# EAGLE design revA (EAGLE 6.3)

## Sheet 1 of 5: MCU
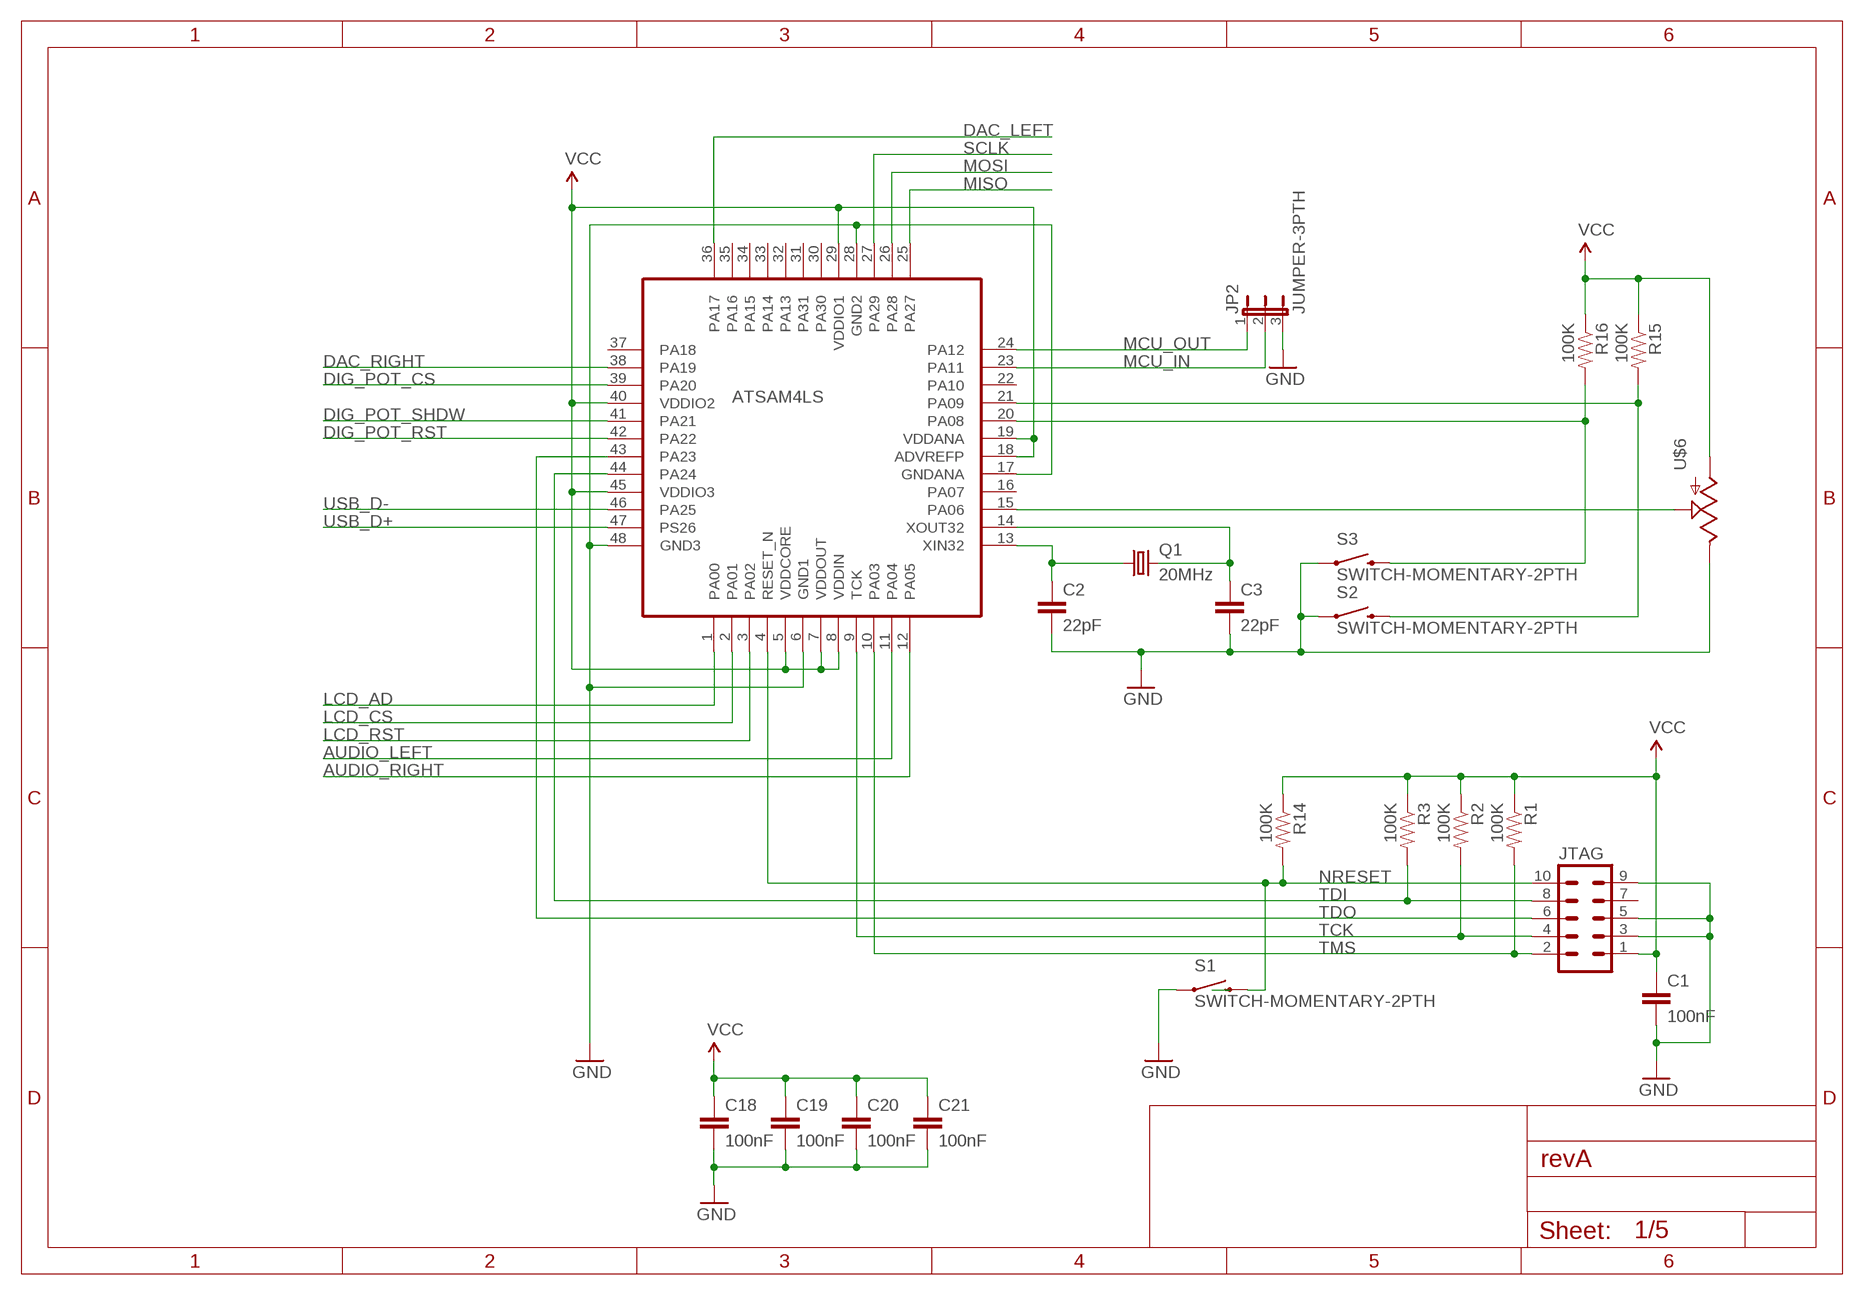
[diagram p0: schematic, sheet 1]

### Parts
ATSAM4LS  ATSAM4LSAA-AUR  [TQFP48]
C1  100nF  CAP0805  [0805]
C2  22pF  CAP0805  [0805]
C3  22pF  CAP0805  [0805]
C18  100nF  CAP0805  [0805]
C19  100nF  CAP0805  [0805]
C20  100nF  CAP0805  [0805]
C21  100nF  CAP0805  [0805]
JP2  JUMPER-3PTH  [1X03]
JTAG  MA05-2  [MA05-2]
Q1  20MHz  CRYSTALHC49UV  [HC49U-V]
R1  100K  RESISTOR1206  [1206]
R2  100K  RESISTOR1206  [1206]
R3  100K  RESISTOR1206  [1206]
R14  100K  RESISTOR1206  [1206]
R15  100K  RESISTOR1206  [1206]
R16  100K  RESISTOR1206  [1206]
S1  SWITCH-MOMENTARY-2PTH  [TACTILE-PTH]
S2  SWITCH-MOMENTARY-2PTH  [TACTILE-PTH]
S3  SWITCH-MOMENTARY-2PTH  [TACTILE-PTH]
U$6  POTTRIM  [TRIM_POT]

### Nets
AUDIO_LEFT: ATSAM4LS.11(PA04) ; also sheet 2
AUDIO_RIGHT: ATSAM4LS.12(PA05) ; also sheet 2
DAC_LEFT: ATSAM4LS.36(PA17) ; also sheet 3
DAC_RIGHT: ATSAM4LS.38(PA19) ; also sheet 3
DIG_POT_CS: ATSAM4LS.39(PA20) ; also sheet 2
DIG_POT_RST: ATSAM4LS.42(PA22) ; also sheet 2
DIG_POT_SHDW: ATSAM4LS.41(PA21) ; also sheet 2
GND: ATSAM4LS.6(GND1) ATSAM4LS.17(GNDANA) ATSAM4LS.28(GND2) ATSAM4LS.48(GND3) C1.2 C2.2 C3.2 C18.2 C19.2 C20.2 C21.2 JP2.3 JTAG.3 JTAG.5 JTAG.9 S1.1 S2.1 S3.1 U$6.2(E) ; also sheet 2,3,4,5
LCD_AD: ATSAM4LS.1(PA00) ; also sheet 5
LCD_CS: ATSAM4LS.2(PA01) ; also sheet 5
LCD_RST: ATSAM4LS.3(PA02) ; also sheet 5
MCU_IN: ATSAM4LS.23(PA11) JP2.2
MCU_OUT: ATSAM4LS.24(PA12) JP2.1
MISO: ATSAM4LS.25(PA27) ; also sheet 2
MOSI: ATSAM4LS.26(PA28) ; also sheet 2,5
N$1: ATSAM4LS.14(XOUT32) C3.1 Q1.2
N$2: ATSAM4LS.13(XIN32) C2.1 Q1.1
N$13: ATSAM4LS.15(PA06) U$6.1(S)
N$14: ATSAM4LS.21(PA09) R15.2 S2.3
N$20: ATSAM4LS.20(PA08) R16.2 S3.3
NRESET: ATSAM4LS.4(RESET_N) JTAG.10 R14.2 S1.3
SCLK: ATSAM4LS.27(PA29) ; also sheet 2,5
TCK: ATSAM4LS.9(TCK) JTAG.4 R2.2
TDI: ATSAM4LS.44(PA24) JTAG.8 R3.2
TDO: ATSAM4LS.43(PA23) JTAG.6
TMS: ATSAM4LS.10(PA03) JTAG.2 R1.2
USB_D+: ATSAM4LS.47(PS26) ; also sheet 4
USB_D-: ATSAM4LS.46(PA25) ; also sheet 4
VCC: ATSAM4LS.5(VDDCORE) ATSAM4LS.7(VDDOUT) ATSAM4LS.8(VDDIN) ATSAM4LS.18(ADVREFP) ATSAM4LS.19(VDDANA) ATSAM4LS.29(VDDIO1) ATSAM4LS.40(VDDIO2) ATSAM4LS.45(VDDIO3) C1.1 C18.1 C19.1 C20.1 C21.1 JTAG.1 R1.1 R2.1 R3.1 R14.1 R15.1 R16.1 U$6.3(A) ; also sheet 2,3,4,5
Unconnected: ATSAM4LS.16(PA07) ATSAM4LS.22(PA10) ATSAM4LS.30(PA30) ATSAM4LS.31(PA31) ATSAM4LS.32(PA13) ATSAM4LS.33(PA14) ATSAM4LS.34(PA15) ATSAM4LS.35(PA16) ATSAM4LS.37(PA18) JTAG.7

## Sheet 2 of 5: Analogue Input Stage
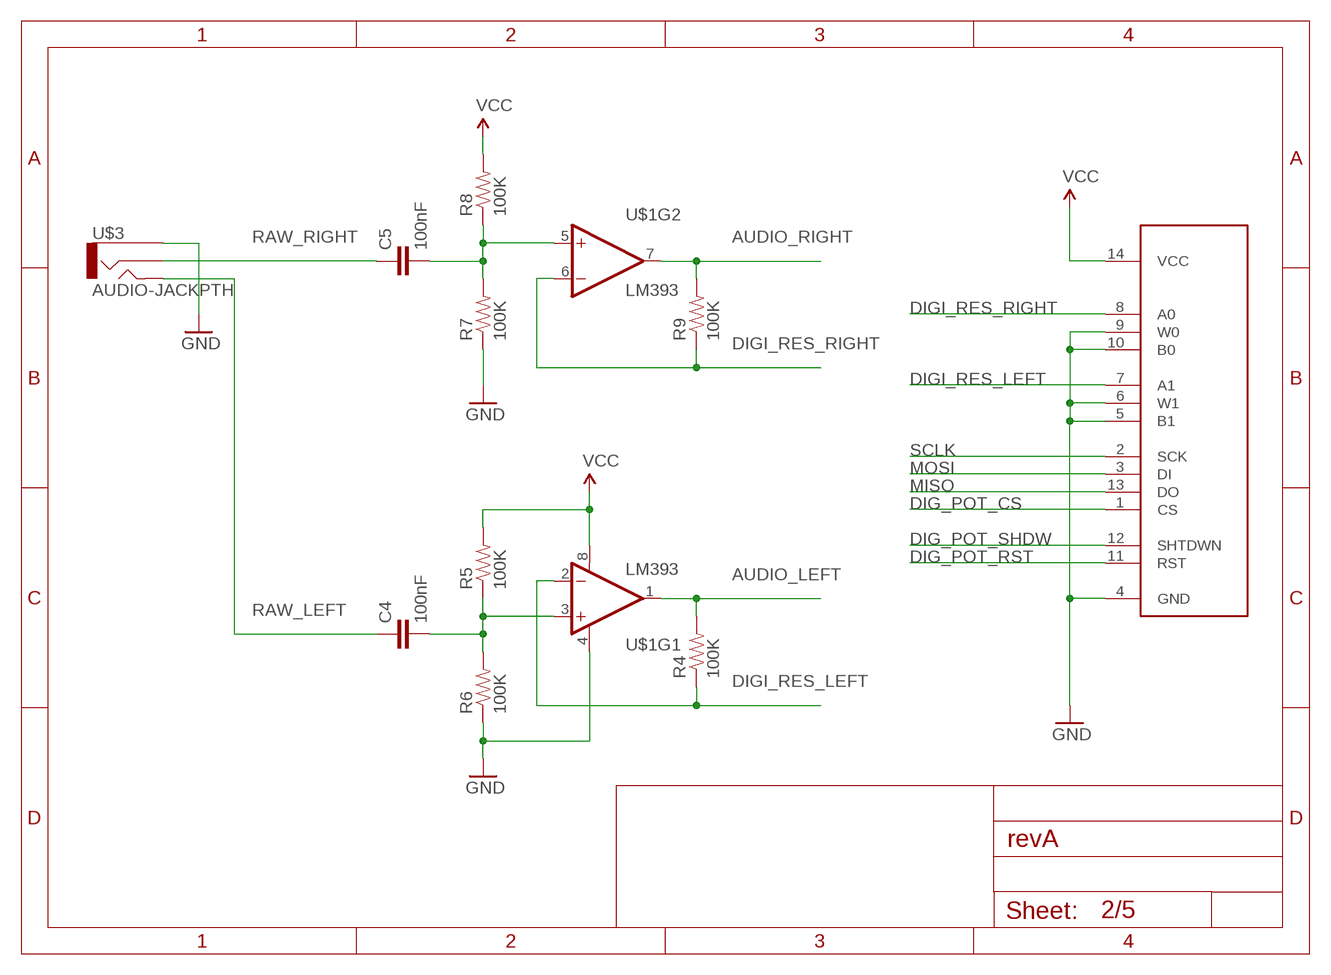
[diagram p1: schematic, sheet 2]

### Parts
C4  100nF  CAP0805  [0805]
C5  100nF  CAP0805  [0805]
R4  100K  RESISTOR1206  [1206]
R5  100K  RESISTOR1206  [1206]
R6  100K  RESISTOR1206  [1206]
R7  100K  RESISTOR1206  [1206]
R8  100K  RESISTOR1206  [1206]
R9  100K  RESISTOR1206  [1206]
U1  MCP42XXX  [SO014]
U$1  LM393  [SO08]
U$3  AUDIO-JACKPTH  [AUDIO-JACK]

### Nets
AUDIO_LEFT: R4.2 U$1.1(OUT) ; also sheet 1
AUDIO_RIGHT: R9.2 U$1.7(OUT) ; also sheet 1
DIG_POT_CS: U1.1(CS) ; also sheet 1
DIG_POT_RST: U1.11(RST) ; also sheet 1
DIG_POT_SHDW: U1.12(SHTDWN) ; also sheet 1
DIGI_RES_LEFT: R4.1 U1.7(A1) U$1.2(-IN)
DIGI_RES_RIGHT: R9.1 U1.8(A0) U$1.6(-IN)
GND: R6.1 R7.1 U1.4(GND) U1.5(B1) U1.6(W1) U1.9(W0) U1.10(B0) U$1.4(V-) U$3.1 ; also sheet 1,3,4,5
MISO: U1.13(DO) ; also sheet 1
MOSI: U1.3(DI) ; also sheet 1,5
N$5: C5.2 R7.2 R8.1 U$1.5(+IN)
N$6: C4.2 R5.1 R6.2 U$1.3(+IN)
RAW_LEFT: C4.1 U$3.5
RAW_RIGHT: C5.1 U$3.2
SCLK: U1.2(SCK) ; also sheet 1,5
VCC: R5.2 R8.2 U1.14(VCC) U$1.8(V+) ; also sheet 1,3,4,5

## Sheet 3 of 5: Analogue Output Stage
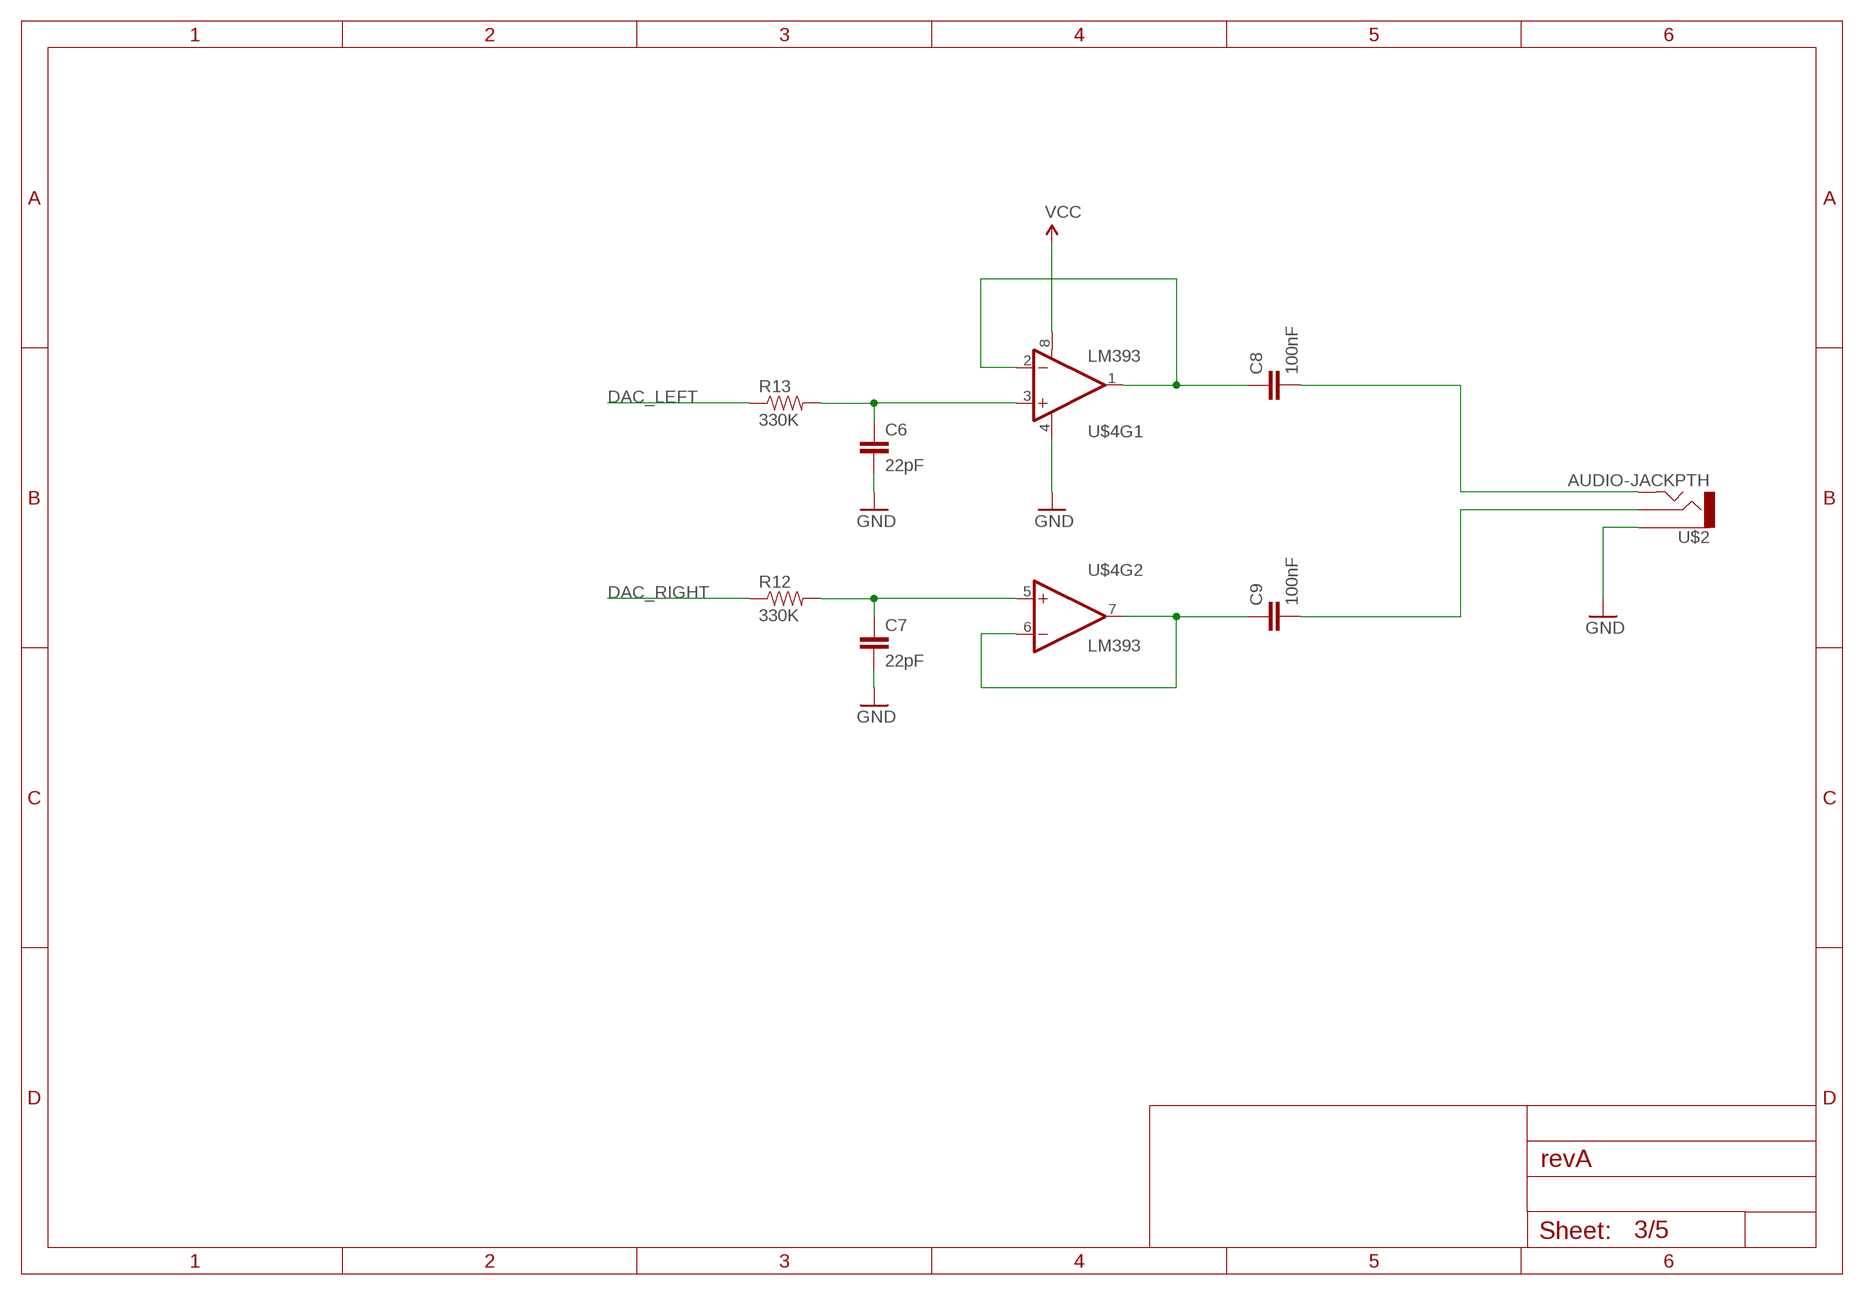
[diagram p2: schematic, sheet 3]

### Parts
C6  22pF  CAP0805  [0805]
C7  22pF  CAP0805  [0805]
C8  100nF  CAP0805  [0805]
C9  100nF  CAP0805  [0805]
R12  330K  RESISTOR1206  [1206]
R13  330K  RESISTOR1206  [1206]
U$2  AUDIO-JACKPTH  [AUDIO-JACK]
U$4  LM393  [SO08]

### Nets
DAC_LEFT: R13.1 ; also sheet 1
DAC_RIGHT: R12.1 ; also sheet 1
GND: C6.2 C7.2 U$2.1 U$4.4(V-) ; also sheet 1,2,4,5
N$7: C9.1 U$4.6(-IN) U$4.7(OUT)
N$8: C9.2 U$2.2
N$9: C8.1 U$4.1(OUT) U$4.2(-IN)
N$10: C6.1 R13.2 U$4.3(+IN)
N$11: C7.1 R12.2 U$4.5(+IN)
N$12: C8.2 U$2.5
VCC: U$4.8(V+) ; also sheet 1,2,4,5

## Sheet 4 of 5: MISC
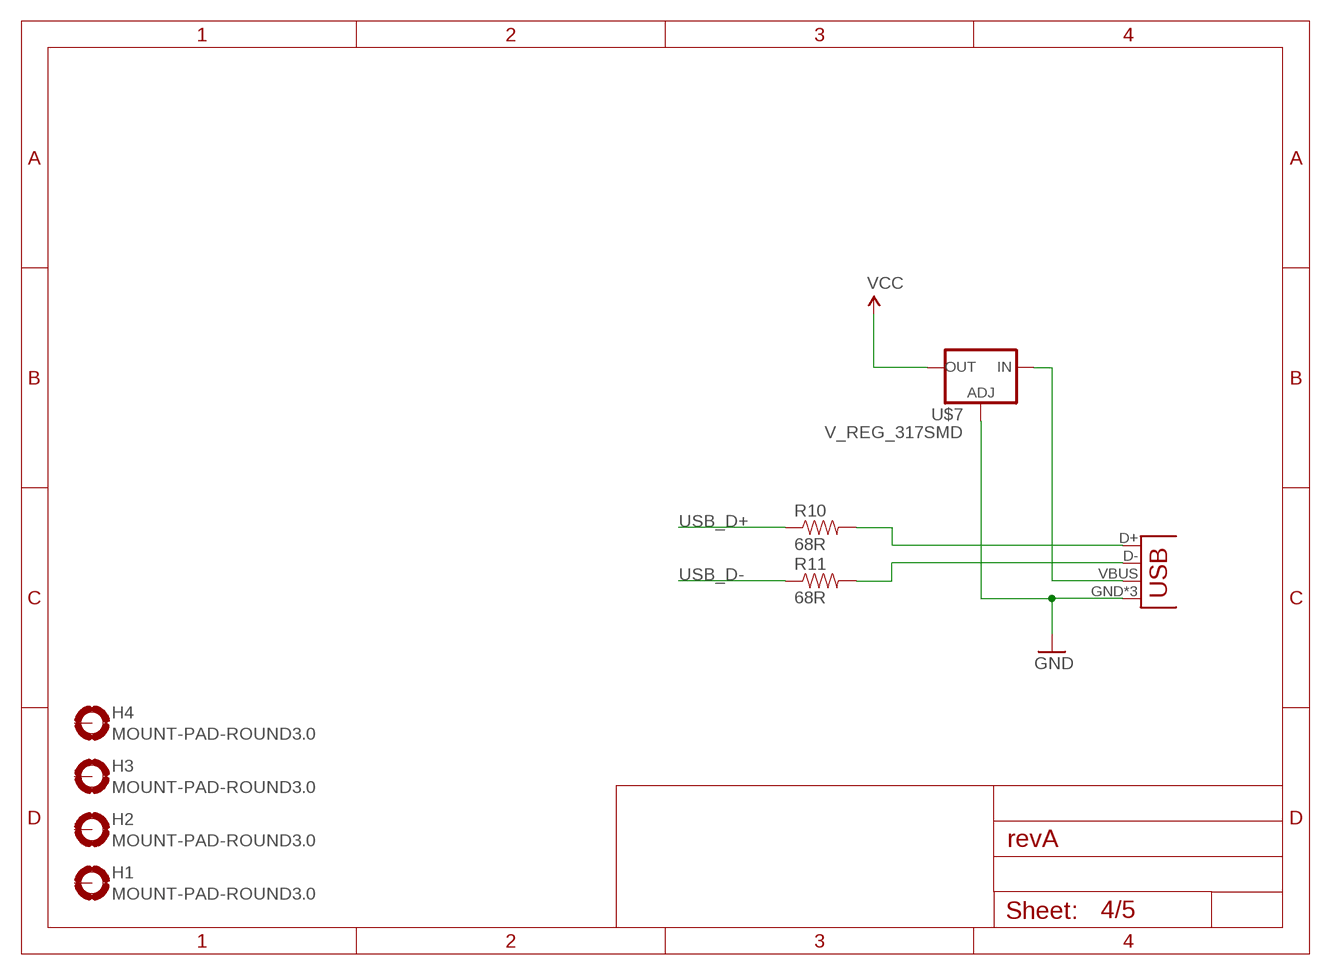
[diagram p3: schematic, sheet 4]

### Parts
H1  MOUNT-PAD-ROUND3.0  [3,0-PAD]
H2  MOUNT-PAD-ROUND3.0  [3,0-PAD]
H3  MOUNT-PAD-ROUND3.0  [3,0-PAD]
H4  MOUNT-PAD-ROUND3.0  [3,0-PAD]
JP1  USB-MICROB  [USB-MICROB]
R10  68R  RESISTOR1206  [1206]
R11  68R  RESISTOR1206  [1206]
U$7  V_REG_317SMD  [SOT223]

### Nets
GND: JP1.GND JP1.MT1(GND) JP1.MT2(GND) U$7.1(ADJ) ; also sheet 1,2,3,5
N$3: JP1.D- R11.2
N$4: JP1.D+ R10.2
N$33: JP1.VBUS U$7.3(IN)
USB_D+: R10.1 ; also sheet 1
USB_D-: R11.1 ; also sheet 1
VCC: U$7.2(OUT) ; also sheet 1,2,3,5
Unconnected: H1.B3,0(MOUNT) H2.B3,0(MOUNT) H3.B3,0(MOUNT) H4.B3,0(MOUNT)

## Sheet 5 of 5: Screen
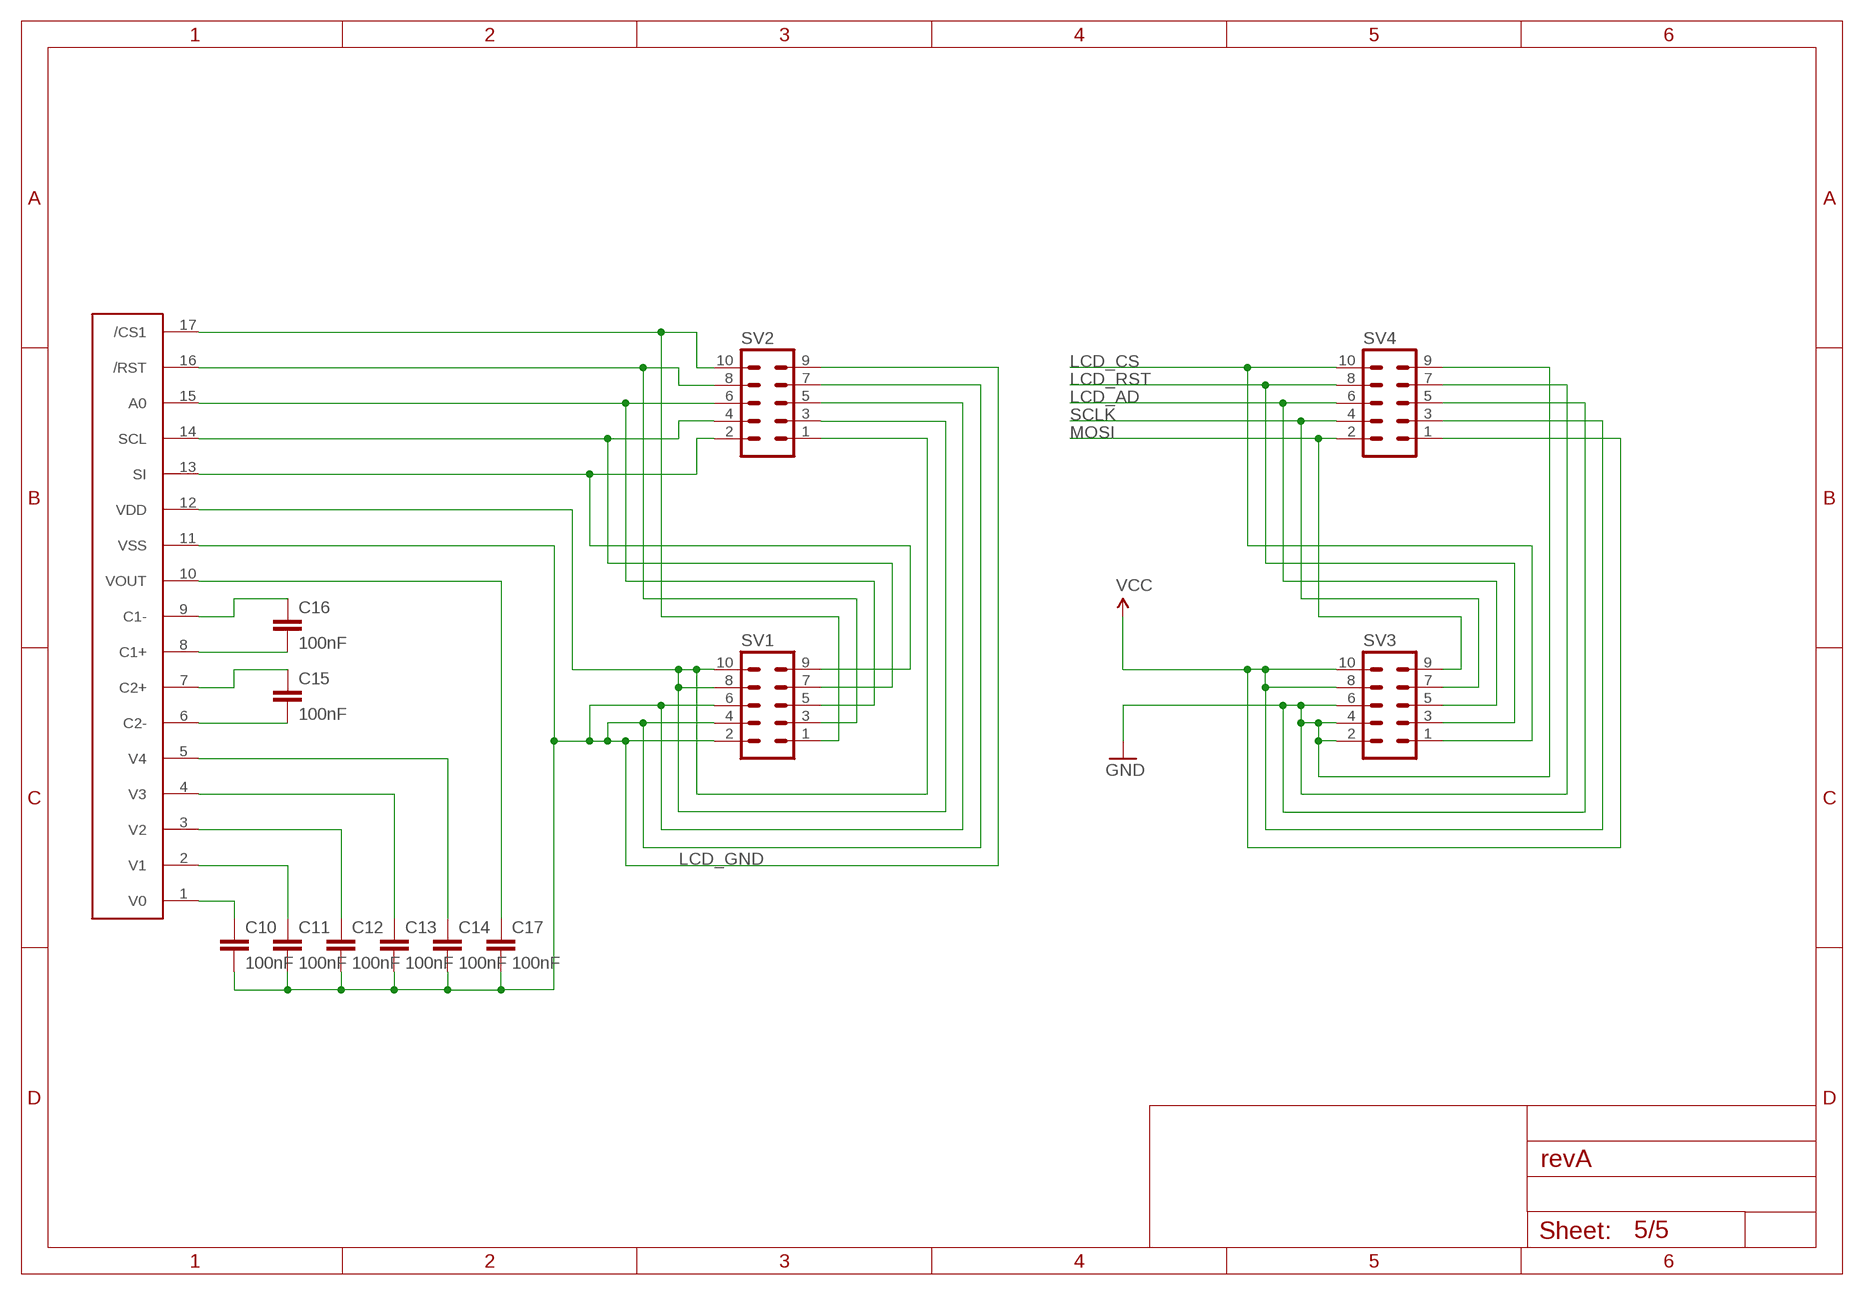
[diagram p4: schematic, sheet 5]

### Parts
C10  100nF  CAP0805  [0805]
C11  100nF  CAP0805  [0805]
C12  100nF  CAP0805  [0805]
C13  100nF  CAP0805  [0805]
C14  100nF  CAP0805  [0805]
C15  100nF  CAP0805  [0805]
C16  100nF  CAP0805  [0805]
C17  100nF  CAP0805  [0805]
SV1  MA05-2  [MA05-2]
SV2  MA05-2  [MA05-2]
SV3  MA05-2  [MA05-2]
SV4  MA05-2  [MA05-2]
U$5  NHD_128X32  [NHD_128X32]

### Nets
GND: SV3.2 SV3.4 SV3.6 SV4.5 SV4.7 SV4.9 ; also sheet 1,2,3,4
LCD_AD: SV3.5 SV4.6 ; also sheet 1
LCD_CS: SV3.1 SV4.10 ; also sheet 1
LCD_GND: C10.2 C11.2 C12.2 C13.2 C14.2 C17.2 SV1.2 SV1.4 SV1.6 SV2.5 SV2.7 SV2.9 U$5.11(VSS)
LCD_RST: SV3.3 SV4.8 ; also sheet 1
MOSI: SV3.9 SV4.2 ; also sheet 1,2
N$15: C10.1 U$5.1(V0)
N$16: C11.1 U$5.2(V1)
N$17: C12.1 U$5.3(V2)
N$18: C13.1 U$5.4(V3)
N$19: C14.1 U$5.5(V4)
N$21: SV1.8 SV1.10 SV2.1 SV2.3 U$5.12(VDD)
N$23: C15.2 U$5.6(C2-)
N$24: C15.1 U$5.7(C2+)
N$25: C16.2 U$5.8(C1+)
N$26: C16.1 U$5.9(C1-)
N$27: C17.1 U$5.10(VOUT)
N$28: SV1.1 SV2.10 U$5.17(/CS1)
N$29: SV1.3 SV2.8 U$5.16(/RST)
N$30: SV1.5 SV2.6 U$5.15(A0)
N$31: SV1.7 SV2.4 U$5.14(SCL)
N$32: SV1.9 SV2.2 U$5.13(SI)
SCLK: SV3.7 SV4.4 ; also sheet 1,2
VCC: SV3.8 SV3.10 SV4.1 SV4.3 ; also sheet 1,2,3,4

## Library data of the parts
ATSAM4LS = atmel:ATSAM4LSAA-AUR
C1-C21 = SparkFun:CAP: Capacitor Standard 0603 ceramic capacitor, and 0.1" leaded capacitor.
H1-H4 = holes:MOUNT-PAD-ROUND: MOUNTING PAD, round
JP1 = SparkFun-Connectors:USB: USB Connectors USB-B-PTH is fully proven SKU : PRT-00139/CONN-08278 USB-miniB is fully proven SKU : PRT-00587 USB-A-PCB is untested. USB-A-H is throughly reviewed, but untested. Spark Fun Electronics SKU : PRT-00437 USB-B-SMT is throughly reviewed, but untested. Needs silkscreen touching up. USB-A-S has not been used/tested USB-MB-H has not been used/tested USB-MICROB has been used. CONN-09505; PROD_ID: CONN-09505
JP2 = SparkFun:JUMPER-3
JTAG SV1-SV4 = con-lstb:MA05-2: PIN HEADER; OC_FARNELL: unknown; OC_NEWARK: unknown
Q1 = SparkFun:CRYSTAL: Crystals Various standard crystals. Proven footprints. Spark Fun Electronics SKU : COM-00534
R1-R16 = SparkFun:RESISTOR: Resistor Basic schematic elements and footprints for 0603, 1206, and PTH 1/10th watt (small) resistors.
S1-S3 = SparkFun:SWITCH-MOMENTARY-2
U1 = SparkFun:MCP42XXX
U$1 U$4 = SparkFun:LM393
U$2 U$3 = SparkFun:AUDIO-JACK: 3.5mm Audio Jack Simple 3.5mm common PCB mount audio jack. SKU: PRT-08032
U$5 = newhaven:NHD_128X32
U$6 = SparkFun:POT
U$7 = SparkFun:V_REG_317: Voltage Regulator Standard LM317 adjustable voltage regulator. AOI (Adjust Output Input). Google 'LM317 Calculator' for easy to use app to get the two resistor values needed. 240/720 for 5V output. 240/390 for 3.3V output. Spark Fun Electronics SKU : COM-00527

## Board
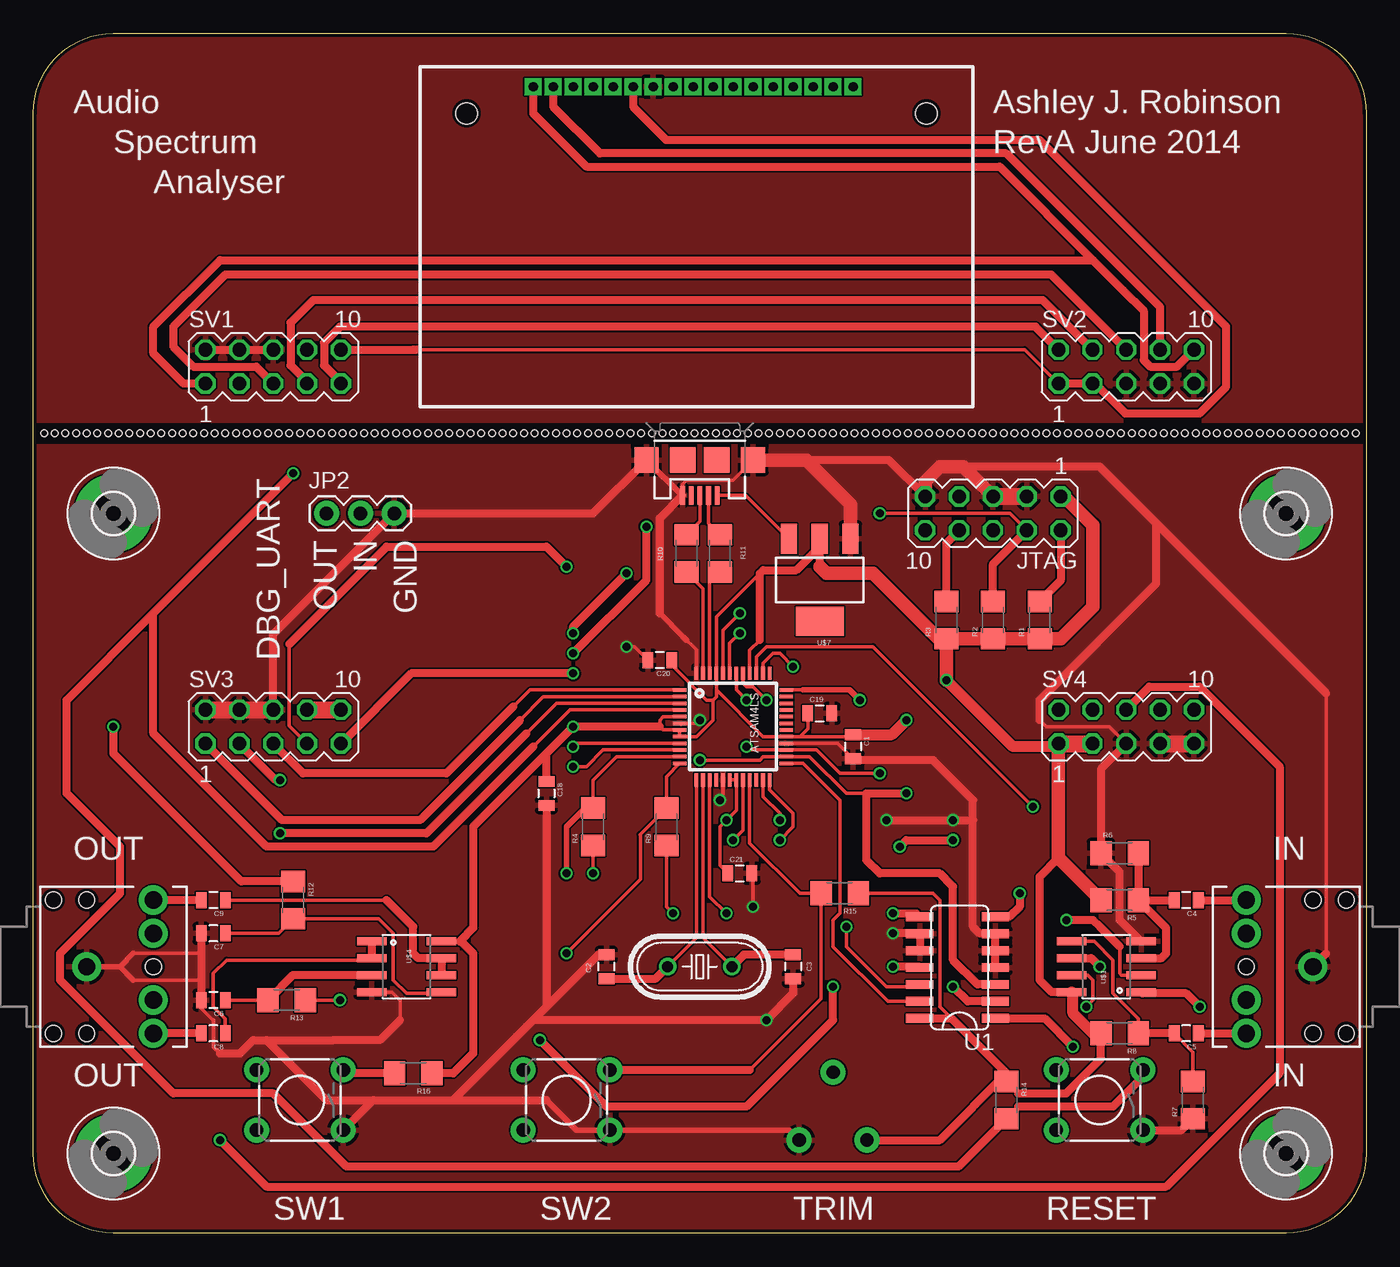
[diagram p5: board, top side]
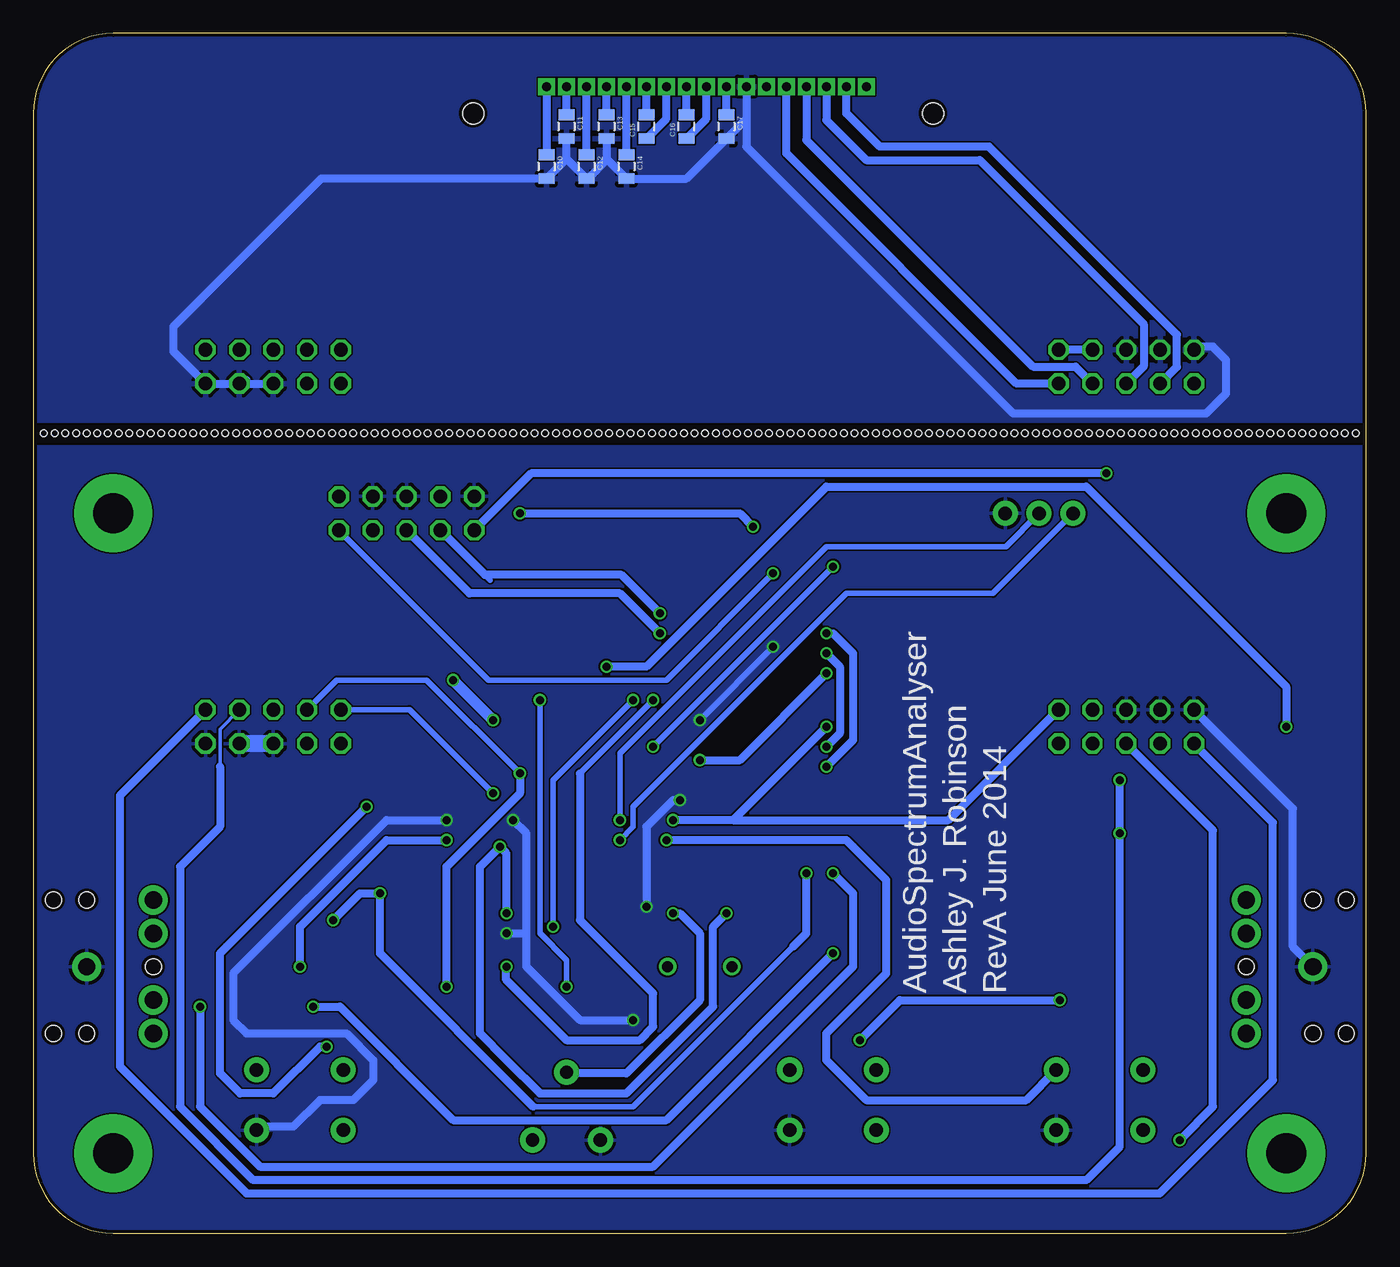
[diagram p6: board, bottom side, seen from below]

Size 100 x 90 mm. Coordinates in mm from the lower left corner, seen from the top.
Outline: 0,6 0,84 arc-90 6,90 94,90 arc-90 100,84 100,6 arc-90 94,0 6,0 arc-90 0,6
Copper layers (1*16): Top 0.035mm / dielectric 1.5mm / Bottom 0.035mm
Design rules "dirt_cheap_dirty_boards.v1": minimum track width 5mil, minimum drill 12mil, track to track 5mil, track to pad 5mil, pad to pad 5mil, via to via 5mil, smd to smd 0mil, copper to edge 10mil, drill to drill 10mil, minimum pad ring 10mil, minimum via ring 6mil, stop-mask expansion 2mil, vias tented up to drill 25mil, thermal gap 10mil
Holes 0.5 mm at 15.2,60 16.8,60 17.6,60 16,60 19.2,60 20,60 18.4,60 21.6,60 22.4,60 20.8,60 24,60 24.8,60 23.2,60 26.4,60 27.2,60 25.6,60 28.8,60 29.6,60 28,60 31.2,60 32,60 30.4,60 33.6,60 34.4,60 32.8,60 36,60 36.8,60 35.2,60 38.4,60 39.2,60 37.6,60 40.8,60 41.6,60 40,60 43.2,60 44,60 42.4,60 44.8,60 45.6,60 47.2,60 48,60 46.4,60 49.6,60 50.4,60 48.8,60 52,60 52.8,60 51.2,60 54.4,60 55.2,60 53.6,60 56.8,60 57.6,60 56,60 59.2,60 60,60 58.4,60 61.6,60 62.4,60 60.8,60 64,60 64.8,60 63.2,60 66.4,60 67.2,60 65.6,60 68.8,60 69.6,60 68,60 71.2,60 72,60 70.4,60 73.6,60 74.4,60 72.8,60 76,60 76.8,60 75.2,60 78.4,60 79.2,60 77.6,60 80.8,60 81.6,60 80,60 83.2,60 84,60 82.4,60 84.8,60 12,60 13.6,60 14.4,60 12.8,60 4.8,60 6.4,60 7.2,60 5.6,60 8.8,60 9.6,60 8,60 11.2,60 10.4,60 1.6,60 3.2,60 4,60 2.4,60 0.8,60 85.6,60 86.4,60 88,60 88.8,60 87.2,60 90.4,60 91.2,60 89.6,60 92.8,60 93.6,60 92,60 95.2,60 96,60 94.4,60 97.6,60 98.4,60 96.8,60 99.2,60

### Footprints (pad centres in the part's own frame; a part is rotated, then mirrored left to right if it is on the bottom)
TQFP48 = smd 0.27 x 1: 1 -2.751,-4.003; 2 -2.251,-4.003; 3 -1.751,-4.003; 4 -1.251,-4.003; 5 -0.751,-4.003; 6 -0.251,-4.003; 7 0.249,-4.003; 8 0.749,-4.003; 9 1.249,-4.003; 10 1.749,-4.003; 11 2.249,-4.003; 12 2.749,-4.003; 25 2.749,3.997; 26 2.249,3.997; 27 1.749,3.997; 28 1.249,3.997; 29 0.749,3.997; 30 0.249,3.997; 31 -0.251,3.997; 32 -0.751,3.997; 33 -1.251,3.997; 34 -1.751,3.997; 35 -2.251,3.997; 36 -2.751,3.997 | smd 1 x 0.27: 13 3.999,-2.753; 14 3.999,-2.253; 15 3.999,-1.753; 16 3.999,-1.253; 17 3.999,-0.753; 18 3.999,-0.253; 19 3.999,0.247; 20 3.999,0.747; 21 3.999,1.247; 22 3.999,1.747; 23 3.999,2.247; 24 3.999,2.747; 37 -4.001,2.747; 38 -4.001,2.247; 39 -4.001,1.747; 40 -4.001,1.247; 41 -4.001,0.747; 42 -4.001,0.247; 43 -4.001,-0.253; 44 -4.001,-0.753; 45 -4.001,-1.253; 46 -4.001,-1.753; 47 -4.001,-2.253; 48 -4.001,-2.753
0805 = smd 0.8 x 1.2: 1 -0.9,0; 2 0.9,0
3,0-PAD = drill 3 pad 5.842: B3,0 0,0
USB-MICROB = smd 0.35 x 1.4: D+ 0,2.65; D- -0.65,2.65; GND 1.3,2.65; ID 0.65,2.65; VBUS -1.3,2.65 | smd 1.8 x 1.9: MT1 -4,0; MT2 4,0 | smd 1.9 x 1.9: P$1 -1.27,0; P$2 1.27,0
1X03 = drill 1.016 pad 1.88: 1 0,0; 2 2.54,0; 3 5.08,0
MA05-2 = drill 1.016 octagon: 1 -5.08,-1.27; 2 -5.08,1.27; 3 -2.54,-1.27; 4 -2.54,1.27; 5 0,-1.27; 6 0,1.27; 7 2.54,-1.27; 8 2.54,1.27; 9 5.08,-1.27; 10 5.08,1.27
HC49U-V = drill 0.813: 1 -2.413,0; 2 2.413,0
1206 = smd 1.6 x 1.8: 1 -1.4,0; 2 1.4,0
TACTILE-PTH = drill 1.016 pad 1.88: 1 -3.251,2.261; 2 3.251,2.261; 3 -3.251,-2.261; 4 3.251,-2.261
SO014 = smd 0.66 x 2.032: 1 -3.175,-2.68; 2 -1.905,-2.68; 3 -0.635,-2.68; 4 0.635,-2.68; 5 1.905,-2.68; 6 3.175,-2.68; 7 4.445,-2.68; 8 4.445,2.997; 9 3.175,2.997; 10 1.905,2.997; 11 0.635,2.997; 12 -0.635,2.997; 13 -1.905,2.997; 14 -3.175,2.997
SO08 = smd 0.61 x 2.21: 1 -1.905,-2.616; 2 -0.635,-2.616; 3 0.635,-2.616; 4 1.905,-2.616; 5 1.905,2.616; 6 0.635,2.616; 7 -0.635,2.616; 8 -1.905,2.616
AUDIO-JACK = drill 1.3 pad 2.184: 1 0,0; 2 5,5; 3 5,2.5; 4 5,-2.5; 5 5,-5 | hole 1.2: 0,5; -2.5,5; -2.5,-5; 0,-5; 5,0
NHD_128X32 = drill 0.7 pad 1.27 square: 1 32.5,24; 2 31,24; 3 29.5,24; 4 28,24; 5 26.5,24; 6 25,24; 7 23.5,24; 8 22,24; 9 20.5,24; 10 19,24; 11 17.5,24; 12 16,24; 13 14.5,24; 14 13,24; 15 11.5,24; 16 10,24; 17 8.5,24 | hole 1.6: 3.5,22; 38,22
TRIM_POT = drill 1 pad 1.88: 1 5.08,0; 2 0,2.54; 3 0,-2.54
SOT223 = smd 1.219 x 2.235: 1 -2.311,-3.099; 2 0,-3.099; 3 2.311,-3.099 | smd 3.6 x 2.2: 4 0,3.099

### Placement (x,y rotation side)
ATSAM4LS  52.5,38 270 top
C1  61.5,36.5 270 top
C2  43,20 90 top
C3  57,20 270 top
C4  86.5,25 180 top
C5  86.5,15 180 top
C6  13.5,17.5 180 top
C7  13.5,22.5 180 top
C8  13.5,15 180 top
C9  13.5,25 180 top
C10  61.5,80 270 bottom
C11  60,83 270 bottom
C12  58.5,80 270 bottom
C13  57,83 270 bottom
C14  55.5,80 270 bottom
C15  54,83 90 bottom
C16  51,83 90 bottom
C17  48,83 270 bottom
C18  38.5,33 270 top
C19  59,39 0 top
C20  47,43 180 top
C21  53,27 0 top
H1  6,6 0 top
H2  94,6 0 top
H3  6,54 0 top
H4  94,54 0 top
JP1  50,58 180 top
JP2  22,54 0 top
JTAG  72,54 180 top
Q1  50,20 0 top
R1  75.5,46 90 top
R2  72,46 90 top
R3  68.5,46 90 top
R4  42,30.5 90 top
R5  81.5,25 180 top
R6  81.5,28.5 0 top
R7  87,10 90 top
R8  81.5,15 180 top
R9  47.5,30.5 90 top
R10  49,51 90 top
R11  51.5,51 90 top
R12  19.5,25 270 top
R13  19,17.5 180 top
R14  73,10 270 top
R15  60.5,25.5 180 top
R16  28.5,12 180 top
S1  80,10 180 top
S2  40,10 180 top
S3  20,10 180 top
SV1  18,65 0 top
SV2  82,65 0 top
SV3  18,38 0 top
SV4  82,38 0 top
U1  69.5,19.3 90 top
U$1  80.5,20 90 top
U$2  4,20 0 top
U$3  96,20 180 top
U$4  28,20 270 top
U$5  29,62 0 top
U$6  60,7 90 top
U$7  59,49 180 top

### Tracks (layer width: path | path; a pad name or v marks a point on that pad's centre or on a via)
AUDIO_LEFT  (via drill 0.6)
  Top 0.254: ATSAM4LS.11 43.75,35.75 42,34 42,32.5 R4.2 | U$1.1 83.21,18
  Top 0.406: v40,27 40,30.5 42,32.5
  Top 0.61: v87.5,17 86.5,18 83.21,18
  Bottom 0.61: v40,27 38.5,25.5 38.5,20 53.5,5 83,5 87.5,9.5 v87.5,17
AUDIO_RIGHT  (via drill 0.6)
  Top 0.254: ATSAM4LS.12 47.5,34.25 R9.2 45.55,29.95 | 45.55,29.95 45.5,29.9 | v79,17 79.5,17.5 79.5,19 79.14,19.36 U$1.7 | v40,21 45.55,26.55 45.55,29.95
  Bottom 0.61: v79,17 77,17 68.5,8.5 52.5,8.5 v40,21
DAC_LEFT  (via drill 0.6)
  Top 0.254: R13.1 v23,17.5 | ATSAM4LS.36 57.75,40.75
  Top 0.406: 57.75,40.75 61.25,40.75 v62,40
  Top 0.61: v60,18.5 60,16 53.5,9.5 43,9.5 v38,14.5
  Bottom 0.406: v60,18.5 60,20.5 62,22.5 v62,40
  Bottom 0.61: v38,14.5 35,17.5 v23,17.5
DAC_RIGHT  (via drill 0.6)
  Top 0.254: ATSAM4LS.38 54.75,42.75 55.5,43.5 56,43.5 v57,42.5
  Top 0.61: v6,38 6,36 15.6,26.4 R12.1
  Bottom 0.61: v6,38 6,41 21,56 40.5,56 54,42.5 v57,42.5
DIG_POT_CS  (via drill 0.6)
  Top 0.254: ATSAM4LS.39 54.25,43.25 55,44 63,44 v75,32
  Top 0.61: U1.1 75.88,16.12 v78,14
  Bottom 0.61: v75,32 85.5,21.5 86,21 86,12 84.5,10.5 82,10.5 78.5,14 v78,14
DIG_POT_RST  (via drill 0.6)
  Top 0.254: ATSAM4LS.42 52.75,40.75 v53.5,40 | U1.11 66.44,20
  Top 0.61: 66.44,20 v64.5,20
  Bottom 0.254: v64.5,20 64.56,19.93
  Bottom 0.406: v53.5,40 59,34.5
  Bottom 0.61: 59,34.5 59,23.5 53.5,18 53.5,15.5 54.5,14.5 60,14.5 64.56,19.07 64.56,19.93
DIG_POT_SHDW  (via drill 0.6)
  Top 0.254: ATSAM4LS.41 53.25,41.25 53.5,41 54,41 v55,40 | v61,23 61,21.5 64,18.5 66.34,18.5 U1.12
  Bottom 0.406: v55,40 61,34 v61,23
DIGI_RES_LEFT  (via drill 0.6)
  Top 0.254: U$1.2 81.64,19.36 81.5,19.5 81.5,21.5 | R4.1 v42,27
  Top 0.406: U1.7 73.25,23.75
  Top 0.61: 81.5,21.5 80,23 79.5,23.5 v77.5,23.5 | v74,25.5 74,24.5 73.25,23.75
  Bottom 0.406: 62.5,9.5 55,9.5 43,21.5
  Bottom 0.61: 43,21.5 42,22.5 v42,27 | 62.5,9.5 74,21 v74,25.5 75.5,25.5 v77.5,23.5
DIGI_RES_RIGHT  (via drill 0.6)
  Top 0.254: R9.1 47.5,24.5 v48,24 | 66.25,24 U1.8
  Top 0.61: v64.5,24 66.25,24 | U$1.6 79.36,20.64 v80,20 | v65,29 65.5,29.5 v69,29.5
  Bottom 0.61: v48,24 49,23 49,17 55.5,10.5 62,10.5 64.5,13 66.5,15 66.5,27.5 v65,29 64.5,28.5 v64.5,24 | v80,20 80,23 73.5,29.5 v69,29.5
GND  (via drill 0.6)
  Top 0.254: 48.65,55.35 JP1.GND 48.7,56.2 49,56.5 52.5,56.5 JP1.MT1 | ATSAM4LS.28 60.35,36.75 C1.2 | 66.48,22.5 U1.9 | U$1.4 83.09,21.91 | 79.5,29 79.6,29 R6.1 | SV4.9 87.73,36.73 | 97,21 97,40.5 | SV4.5 80.73,38 76,38 75.5,38.5 | C6.2 12.6,16.9 13.5,16 | 7.5,19 12.6,19 | U$4.4 26.91,18.09 27.5,17.5 27.5,16 | C2.2 42.4,20.9 | 37.5,16 37,15.5 | ATSAM4LS.48 49.75,43.75 48.75,44.75 | 7.5,21 12.6,21 | ATSAM4LS.17 51.75,32.75 v51.5,32.5 | v54,24.5 54,26.9 C21.2 | 38.5,17 36.25,14.75 | ATSAM4LS.6 49.75,38.25 v50,38.5 | v44.5,44 45.1,44 C20.2
  Top 0.305: 13.5,16 13.5,14 14,13.5 | S3.1 23.25,8.25
  Top 0.406: 48.65,55.35 JP1.MT2 | 61.6,35.5 C1.2 | 38.5,10 40.76,7.74 S2.1 56.72,7.74 U$6.2 | 47,46.5 48.75,44.75 49,44.5 | 6.5,20 7.5,21 | 6.5,20 7.5,19 | U$2.1 6.5,20
  Top 0.61: JP1.MT2 42,54 JP2.3 18,44.92 SV3.6 | C7.2 12.6,21 12.6,19 C6.2 | U1.9 U1.10 | U1.4 U1.5 U1.6 71.03,22.48 70.5,23 70.5,31 | 83.09,21.91 81.5,23.5 81.5,27.1 R6.1 80.1,34.83 SV4.5 | 97,40.5 84.25,53.25 | 84.25,53.25 80,57.5 68,57.5 | S1.1 86.14,7.74 R7.1 | U$3.1 97,21 | 75.5,38.5 75.5,40 84.25,48.75 84.25,53.25 | 25.51,10 31.5,10 | 31.5,10 38.5,10 | 70.5,31 70.5,32.5 67.5,35.5 61.6,35.5 | 42.4,20.9 37,15.5 36.25,14.75 31.5,10 | 27.5,16 26,14.5 22.5,14.5 17.5,14.5 | 37.5,16 v55,16 57,18 C3.2 | JTAG.9 64.19,58 57.5,58 | 47,46.5 47,53.65 JP1.GND | v64,31 v69,31 70.5,31 | 66.48,22.5 v64.5,22.5 | C18.2 38.5,17 | 14,13.5 15.5,13.5 16.5,14.5 17.5,14.5 | 25.51,10 S3.1 | 17.5,14.5 22,10 25.51,10
  Top 1.016: JP1.MT1 57.5,58 58,58 61.31,54.69 U$7.1 | JTAG.9 66.92,56.42 68,57.5 69.77,57.5 JTAG.5
  Top 1.27: JTAG.5 JTAG.3 | SV3.2 SV3.4 SV3.6 | SV4.7 SV4.9
  Bottom 0.254: S1.1
  Bottom 0.406: v50,38.5 v44.5,44
  Bottom 0.61: v55,16 59,16 63,20 63,22.5 | v69,31 73.5,31 85,19.5 85,16 84,15 76.5,15 74.5,13 74.5,11.5 76,10 78.5,10 80.5,8 82.99,8 S1.1 | 63,22.5 63,30 v64,31 | v64.5,22.5 63,22.5 | v51.5,32.5 52,32.5 54,30.5 v54,24.5 | U$2.1 5.5,21.5 5.5,31.85 SV3.2
  Bottom 1.27: SV4.5 SV4.7
  pour Bottom: -1,-1 -1,59 101,59 101,-1
  pour Top: -1,-1 -1,59 101,59 101,-1
LCD_AD  (via drill 0.6)
  Top 0.254: ATSAM4LS.1 37.25,40.75 36,39.5
  Top 0.61: SV4.6 83.73,41 87.5,41 93.5,35 93.5,12 85.75,4.25 85.5,4 85,3.5 17.5,3.5 v14,7 | 36,39.5 31,34.5 20.23,34.5 SV3.5
  Bottom 0.61: SV3.5 11.5,30.23 11.5,9.5 v14,7
LCD_CS
  Top 0.254: ATSAM4LS.2 38.25,40.25 36.5,38.5
  Top 0.61: 36.5,38.5 29,31 18.65,31 SV3.1
  Bottom 0.61: SV4.10 93.5,32.85 93.5,12.5 84,3 15.5,3 7,11.5 7,30.81 SV3.1
LCD_GND
  Top 0.61: SV1.2 SV1.4 SV1.6
  Bottom 0.61: C13.2 57,80.6 56.95,80.55 | 56.95,80.55 C14.2 51,79.1 C17.2 46.5,83.6 | 56.95,80.55 58.4,79.1 C12.2 59.95,80.55 | 59.95,80.55 60,80.6 C11.2 | 59.95,80.55 60.05,80.55 C10.2 78.4,79.1 89.5,68 89.5,66.15 SV2.9 SV2.7 | U$5.11 46.5,83.6 | SV2.7 84.27,63.73 84,64 84.27,64 SV2.7 | SV2.7 SV2.5 | 46.5,83.6 46.5,81.5 26.5,61.5 12,61.5 10.5,63 10.5,65.5 11.5,66.5 12.69,66.5 SV1.2
  pour Bottom: -1,61 -1,91 101,91 101,61
  pour Top: -1,61 -1,91 101,91 101,61
LCD_RST  (via drill 0.6)
  Top 0.254: ATSAM4LS.3 39.25,39.75 37,37.5
  Top 0.61: v18.5,34 18.19,34 SV3.3 | 37,37.5 29.5,30 v18.5,30
  Bottom 0.254: 15.23,36.73 SV3.3 | 86,35 86,37.81 SV4.8
  Bottom 0.61: 86,35 86,30.5 89,27.5 89,9.5 83.5,4 21,4 18.5,6.5 v18.5,30 v18.5,34
MCU_IN  (via drill 0.6)
  Top 0.254: ATSAM4LS.23 54.75,32.75 56,31.5 v56,31
  Bottom 0.406: v56,31 56,36 40.5,51.5 27.04,51.5 JP2.2
MCU_OUT  (via drill 0.6)
  Top 0.254: ATSAM4LS.24 55.25,33.25 57,31.5 57,30.5 v56,29.5
  Bottom 0.406: JP2.1 28,48 39,48 55,32 55,30.5 v56,29.5
MISO
  Top 0.254: ATSAM4LS.25 57.75,35.25 60.5,32.5 60.5,24 60,23.5 60,21.5 64.11,17.39 U1.13
MOSI  (via drill 0.6)
  Top 0.254: v50,35.5 54.5,35.5 54.75,35.75 ATSAM4LS.26 58.25,35.75 61,33 62.5,33
  Top 0.61: U1.3 70.83,18.66 69,20.5 69,26 68,27 63.5,27 62.5,28 62.5,33 v65.5,33 | v40.5,42 28.35,42 SV3.9
  Bottom 0.406: SV4.2 71.77,39.27 v65.5,33
  Bottom 0.61: v50,35.5 47,35.5 v40.5,42
N$1
  Top 0.254: ATSAM4LS.14 50.25,22.17 Q1.2
  Top 0.61: C3.1 53.31,20.9 Q1.2
N$2
  Top 0.254: ATSAM4LS.13 49.75,22.16 Q1.1
  Top 0.61: C2.1 46.69,19.1 Q1.1
N$3
  Top 0.254: JP1.D- 50.65,53.25 R11.2
N$4
  Top 0.254: JP1.D+ 50,53.4 R10.2
N$5
  Top 0.254: U$1.5 79.59,21.91 81,20.5 81,18 82.9,16.1 R8.1 | R7.2 87,13.6 C5.2
  Top 0.61: C5.2 R8.1
N$6
  Top 0.61: R5.1 C4.2 | R5.1 85,22.9 85,21 84.64,20.64 U$1.3 | R6.2 R5.1
N$7
  Top 0.254: C9.1 26.5,25
  Top 0.61: U$4.6 U$4.7 28.86,20.64 28.5,21 28.5,23 26.5,25
N$8
  Top 0.61: C9.2 U$2.2
N$9
  Top 0.254: U$4.2 25.25,20.5 14.5,20.5 13.5,19.5 13.5,17 14.4,16.1 C8.1
  Top 0.61: U$4.1 U$4.2
N$10
  Top 0.254: C6.1 R13.2
  Top 0.61: U$4.3 19.46,19.36 R13.2
N$11
  Top 0.254: U$4.5 30.52,18 28,18 27,19 27,22.5 25.9,23.6 R12.2 18.4,22.5 C7.1
N$12
  Top 0.61: C8.2 U$2.5
N$13  (via drill 0.6)
  Top 0.254: ATSAM4LS.15 50.75,25.25 v52,24
  Bottom 0.406: 59.92,12 U$6.1
  Bottom 0.61: v52,24 51.5,24 50,22.5 50,17.5 55.5,12 59.92,12
N$14
  Top 0.254: 53.76,12.26 59.1,17.6 R15.2 57.5,25.5 53.75,29.25 ATSAM4LS.21
  Top 0.61: S2.3 53.76,12.26
N$15
  Bottom 0.61: U$5.1 C10.1
N$16
  Bottom 0.61: C11.1 U$5.2
N$17
  Bottom 0.61: C12.1 U$5.3
N$18
  Bottom 0.61: C13.1 U$5.4
N$19
  Bottom 0.61: C14.1 U$5.5
N$20  (via drill 0.6)
  Top 0.254: ATSAM4LS.20 53.25,30.25 v52.5,29.5
  Top 0.61: R16.2 23.51,12 S3.3
  Bottom 0.61: S3.3 25.51,10 37.5,10 40.5,13 40.5,15 36,19.5 36,26.5 38.5,29 39,29.5 v52.5,29.5
N$21
  Top 0.254: 28.5,66.27 74.38,66.27 SV2.1
  Top 0.61: SV1.10 28.5,66.27 28.77,66.27 | SV2.1 SV2.3 79.46,63.96 81.92,61.5 87.5,61.5 89.5,63.5 89.5,68 75.5,82 47.5,82 45,84.5 U$5.12
  Bottom 0.61: SV1.8 SV1.10
N$23
  Bottom 0.61: C15.2 U$5.6
N$24
  Bottom 0.61: C15.1 52.5,83.6 U$5.7
N$25
  Bottom 0.61: C16.2 U$5.8
N$26
  Bottom 0.61: C16.1 49.5,83.6 U$5.9
N$27
  Bottom 0.61: C17.1 U$5.10
N$28
  Top 0.61: U$5.17 37.5,84 41.5,80 72.5,80 79.5,73 | SV2.10 85.81,65 83.8,65 83.3,65.5 83.3,69.2 81.75,70.75 79.5,73 | SV1.1 11.27,63.73 9,66 9,68 14,73 79.5,73
N$29
  Top 0.61: U$5.16 39,84.5 42.5,81 73,81 84.54,69.46 SV2.8
  Bottom 0.61: SV1.3 14.2,64.99 14.2,67.4 28.3,81.5 36.5,81.5 39,84 U$5.16
N$30
  Top 0.61: SV2.6 76.37,71.9 14.4,71.9 10.5,68 10.5,66.5 12,65 16.73,65 SV1.5
  Bottom 0.61: U$5.15 40.5,83.5 37.5,80.5 29,80.5 16.7,68.2 16.7,65.03 SV1.5
N$31
  Top 0.61: SV2.4 75.73,70 21,70 19.3,68.3 19.3,65.1 20.54,63.86 SV1.7
  Bottom 0.61: U$5.14 42,82 25,65 21.81,65 SV1.7
N$32
  Top 0.61: SV2.2 75.19,68 23,68 21.8,66.8 21.8,65.1 23.08,63.82 SV1.9
  Bottom 0.61: SV1.9 26.23,63.73 43.5,81 U$5.13
N$33
  Top 0.254: 56.29,52.5 U$7.3 53.44,55.35 JP1.VBUS
NRESET  (via drill 0.6)
  Top 0.254: S1.3 83.25,11.75 | 73.9,9.5 R14.2 | ATSAM4LS.4 40.25,39.25 37.5,36.5
  Top 0.61: 9,46.5 2.5,40 2.5,33 6.5,29 6.5,25.5 2,21 2,19 10.5,10.5 18,10.5 23.5,5 69.4,5 R14.2 | v19.5,57 9.75,47.25 9,46.5 | 83.25,11.75 81,9.5 73.9,9.5 | 37.5,36.5 30,29 17.5,29 9,37.5 9,46.5
  Bottom 0.61: v19.5,57 62.65,57 JTAG.10
RAW_LEFT
  Top 0.61: C4.1 U$3.5
RAW_RIGHT
  Top 0.61: C5.1 U$3.2
SCLK  (via drill 0.6)
  Top 0.254: v63.5,34.5 60.5,34.5 58.75,36.25 ATSAM4LS.27 53.75,36.25 v53.5,36.5 | SV3.7 19.2,38.07 19.2,44.2
  Top 0.61: U1.2 70.11,17.39 v69,18.5 | 19.2,44.2 26.5,51.5 38.5,51.5 v40,50
  Bottom 0.406: v40,50 v53.5,36.5 | v63.5,34.5 70.5,41.5 77.23,41.5 SV4.4
  Bottom 0.61: v69,18.5 69,27.5 63.5,33 v63.5,34.5
TCK  (via drill 0.6)
  Top 0.254: JTAG.4 73.27,54 v63.5,54 | ATSAM4LS.9 40.75,36.75 v40.5,36.5
  Top 0.61: v40.5,43.5 46,49 v46,53 | R2.2 72,50.19 JTAG.4
  Bottom 0.61: v40.5,36.5 39.5,37.5 39.5,42.5 v40.5,43.5 | v63.5,54 47,54 v46,53
TDI  (via drill 0.6)
  Top 0.254: ATSAM4LS.44 51.75,45.25 v53,46.5
  Top 0.61: R3.2 68.5,51.77 JTAG.8
  Bottom 0.406: 65.73,49 66.11,49.38
  Bottom 0.61: JTAG.8 66.11,49.38 55.88,49.38 v53,46.5
TDO  (via drill 0.6)
  Top 0.254: ATSAM4LS.43 52.25,44.25 v53,45
  Bottom 0.61: v53,45 56,48 67.27,48 JTAG.6
TMS  (via drill 0.6)
  Top 0.254: ATSAM4LS.10 42.75,36.25 41.5,35 v40.5,35
  Top 0.61: v40.5,45 40.5,45.5 v44.5,49.5 | JTAG.2 77.08,48.98 R1.2
  Bottom 0.254: v40.5,45 40,45
  Bottom 0.406: v44.5,49.5 52.5,41.5 65.85,41.5 JTAG.2
  Bottom 0.61: 40,45 38.5,43.5 38.5,37 v40.5,35
USB_D+
  Top 0.254: ATSAM4LS.47 50.25,48.35 R10.1
USB_D-
  Top 0.254: ATSAM4LS.46 50.75,48.85 R11.1
VCC  (via drill 0.6)
  Top 0.254: JTAG.1 77.21,55.4 | 57.5,37.25 ATSAM4LS.29 54.75,37.25 51.25,40.75 | 57.5,37.25 61.35,37.25 C1.1 | U$1.8 76.59,18.09 | ATSAM4LS.5 47.25,38.75 47,38.5 47,38 47.25,37.75 ATSAM4LS.7 ATSAM4LS.8 49.75,37.25 51,38.5 51,40 | R15.1 67.5,25.5 68,25 68,17 68.88,16.12 | ATSAM4LS.18 ATSAM4LS.19 52.75,31.75 v52,31 51.5,30.5 51.5,27.6 C21.1 | R3.1 68.5,44 | 76.69,36.5 SV4.1 | 73,12 R14.1 73.9,10.5 | 54.75,49.75 54.5,49.5 51.25,46.25 ATSAM4LS.45 51.25,40.75 | 59,51.5 U$7.2 | ATSAM4LS.40 53.75,43.75 54.5,44.5 | C19.1 58.1,37.85 57.5,37.25 | C20.1 47.9,42.6 50.5,40 51,40 | 51,40 51.25,40.25 51.25,40.75
  Top 0.406: U$4.8 32,21.91 32.09,21.91 | 29.5,12 R16.1
  Top 0.61: U$1.8 76.41,18.09 75.5,19 75.5,26.76 76.92,28.18 | 47,38 v40.5,38 38.5,36 | R8.2 80.1,13.1 77.5,10.5 73.9,10.5 | 32.09,21.91 33,21 33,13.5 31.5,12 R16.1 | 32,21.91 33,22.91 33,30.5 38.5,36 | 59,50 59,51.5 57.25,49.75 54.75,49.75 | 54.5,44.5 54.5,49.5 | U$6.3 68,7 73,12 68.88,16.12 U1.14 | C18.1 38.5,36
  Top 0.813: C1.1 64.4,37.4 v65.5,38.5 | 76.69,36.5 73.5,36.5 v68.5,41.5 | R8.2 79.5,15 78,16.5 78,17.98 U$1.8
  Top 1.016: R5.2 76.92,28.18 SV4.1 | v68.5,41.5 68.5,44 63,49.5 59.5,49.5 59,50 | 77.21,55.4 79.5,53.11 79.5,47 77.1,44.6 R1.1 R2.1 R3.1
  Top 1.27: SV3.8 SV3.10 | SV4.1 SV4.3
  Bottom 0.61: 47.5,31 31.35,31 SV3.10 | v40.5,38 47.5,31 | 47.5,31 v52,31
  Bottom 0.813: v65.5,38.5 v68.5,41.5

### Text on the board
tPlace: Audio | Ashley J. Robinson | Spectrum | RevA June 2014 | Analyser | OUT | IN | GND | DBG_UART | OUT | IN | OUT | IN | SW1 | SW2 | TRIM | RESET
bPlace: RevA June 2014 | Ashley J. Robinson | AudioSpectrumAnalyser